# EAGLE design sample_holder (EAGLE 9.3.0)
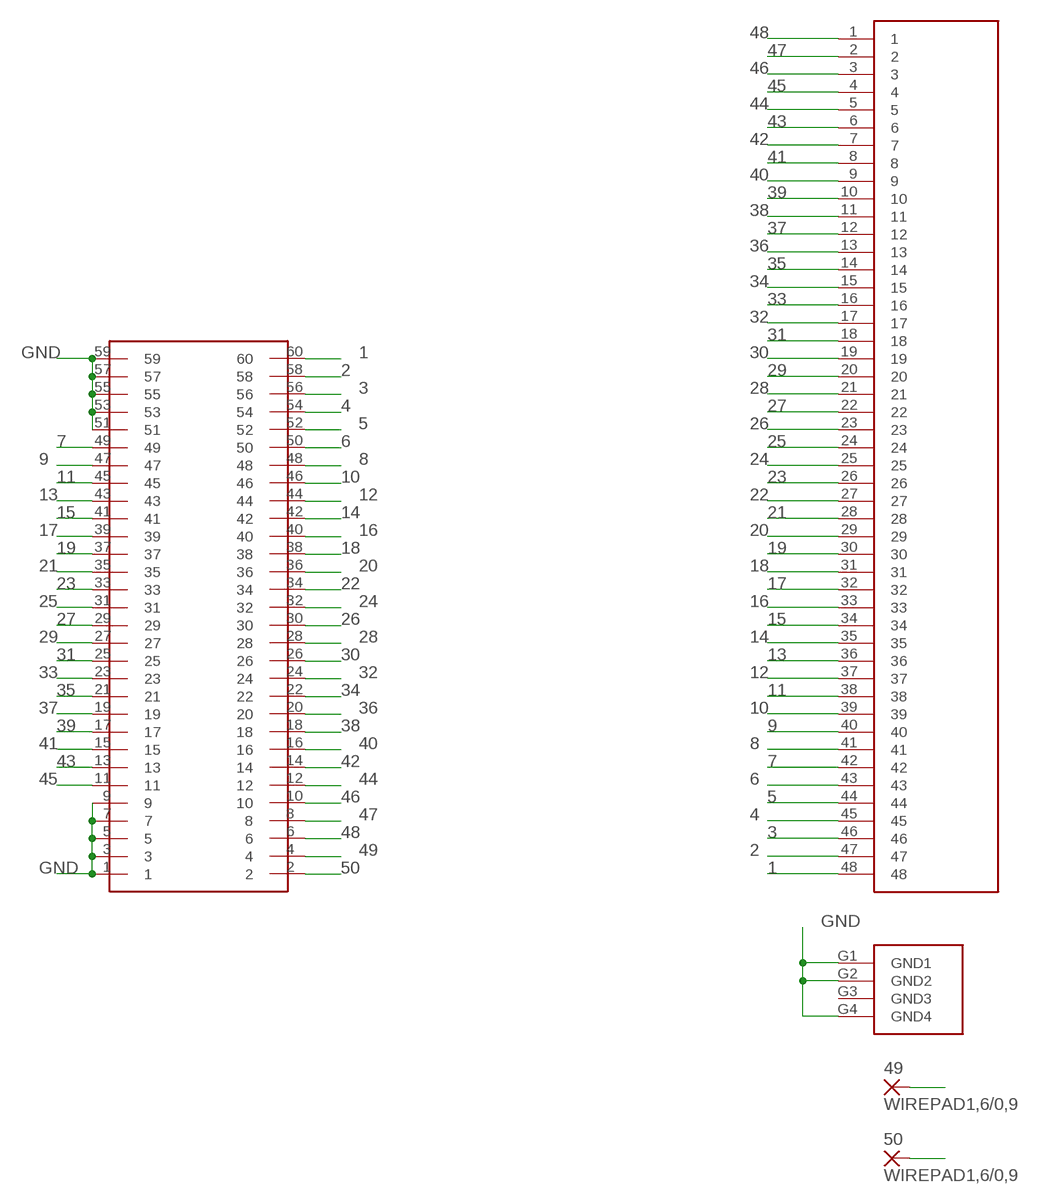
[diagram p0: schematic, sheet 1]

## Parts
49  WIREPAD1,6/0,9  [1,6/0,9]
50  WIREPAD1,6/0,9  [1,6/0,9]
U$1  MEC5-030-CARD-ALL  [MEC-030-CARD-ALL]
U$2  FOLKLAB-48PADS  [FOLKLAB-48PADS]

## Nets
1: U$1.60 U$2.48
2: U$1.58 U$2.47
3: U$1.56 U$2.46
4: U$1.54 U$2.45
5: U$1.52 U$2.44
6: U$1.50 U$2.43
7: U$1.49 U$2.42
8: U$1.48 U$2.41
9: U$1.47 U$2.40
10: U$1.46 U$2.39
11: U$1.45 U$2.38
12: U$1.44 U$2.37
13: U$1.43 U$2.36
14: U$1.42 U$2.35
15: U$1.41 U$2.34
16: U$1.40 U$2.33
17: U$1.39 U$2.32
18: U$1.38 U$2.31
19: U$1.37 U$2.30
20: U$1.36 U$2.29
21: U$1.35 U$2.28
22: U$1.34 U$2.27
23: U$1.33 U$2.26
24: U$1.32 U$2.25
25: U$1.31 U$2.24
26: U$1.30 U$2.23
27: U$1.29 U$2.22
28: U$1.28 U$2.21
29: U$1.27 U$2.20
30: U$1.26 U$2.19
31: U$1.25 U$2.18
32: U$1.24 U$2.17
33: U$1.23 U$2.16
34: U$1.22 U$2.15
35: U$1.21 U$2.14
36: U$1.20 U$2.13
37: U$1.19 U$2.12
38: U$1.18 U$2.11
39: U$1.17 U$2.10
40: U$1.16 U$2.9
41: U$1.15 U$2.8
42: U$1.14 U$2.7
43: U$1.13 U$2.6
44: U$1.12 U$2.5
45: U$1.11 U$2.4
46: U$1.10 U$2.3
47: U$1.8 U$2.2
48: U$1.6 U$2.1
49: 49.1(P) U$1.4
50: 50.1(P) U$1.2
GND: U$1.1 U$1.3 U$1.5 U$1.7 U$1.9 U$1.51 U$1.53 U$1.55 U$1.57 U$1.59 U$2.G1(GND1) U$2.G2(GND2) U$2.G4(GND4)
Unconnected: U$2.G3(GND3)

## Library data of the parts
49 50 = wirepad:WIREPAD: Wire PAD connect wire on PCB
U$1 = MEC5-030-01-L-RA-CARD:MEC5-030-CARD-ALL
U$2 = FolkLab-48pads:FOLKLAB-48PADS

## Net classes
0 default: width 0.152 mm, clearance 0.152 mm

## Board
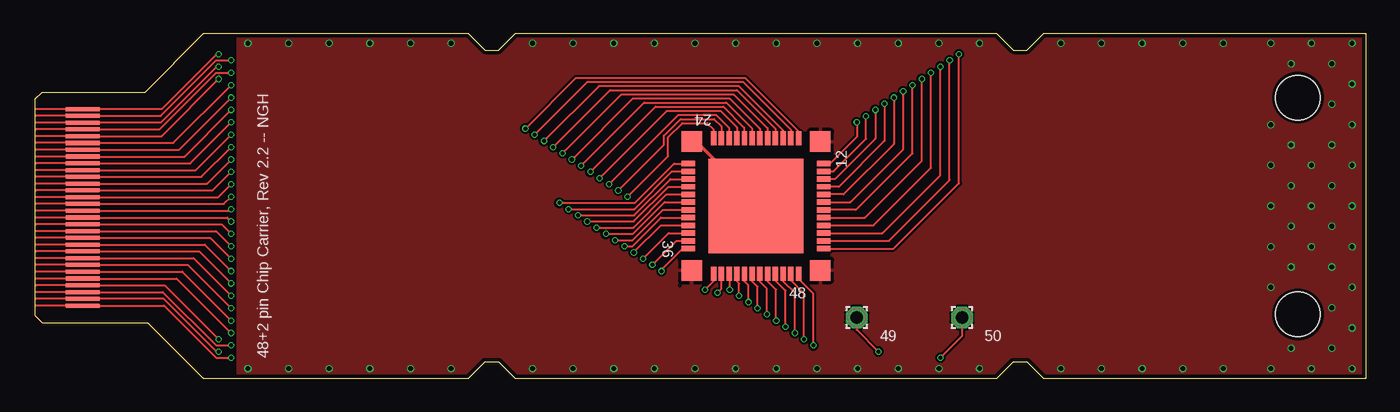
[diagram p1: board, top side]
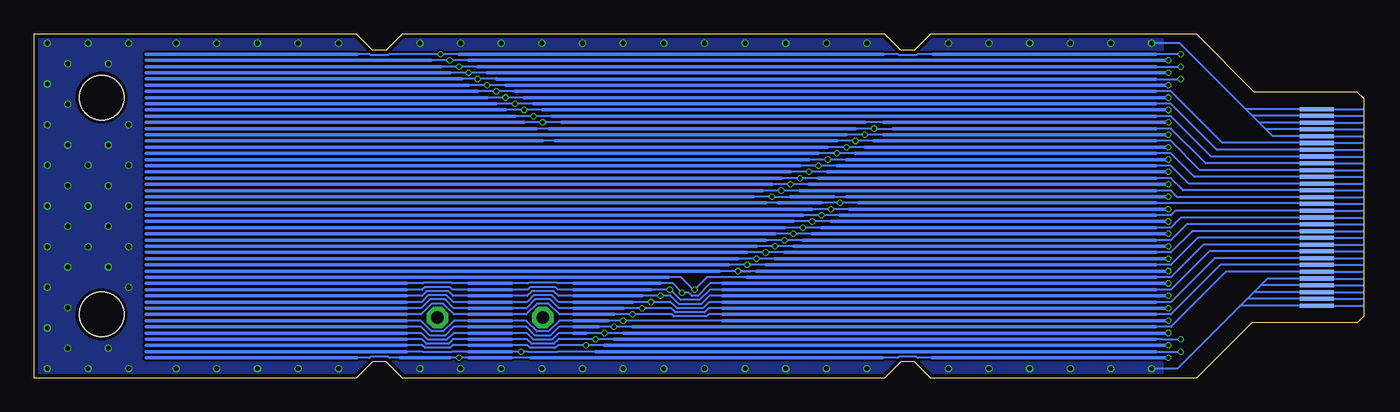
[diagram p2: board, bottom side, seen from below]

Size 98.2 x 25.4 mm. Coordinates in mm from the lower left corner, seen from the top.
Outline: 98.2,25.4 98.2,0 74.4,0 73.2,1.2 72.2,1.2 71,0 35.4,0 34.2,1.2 33.2,1.2 32,0 12.4,0 8.3,4.1 0.5,4.1 0,4.6 0,20.6 0.5,21.1 3.1,21.1 8,21.1 8.1,21.1 12.4,25.4 32,25.4 33.2,24.2 34.2,24.2 35.4,25.4 71,25.4 72.2,24.2 73.2,24.2 74.4,25.4 98.2,25.4
Copper layers (1*16): Top 0.035mm / dielectric 0.2mm / Bottom 0.035mm
Design rules "default *": minimum track width 6mil, minimum drill 10mil, track to track 6mil, track to pad 6mil, pad to pad 6mil, via to via 6mil, smd to smd 6mil, copper to edge 10mil, drill to drill 10mil, minimum pad ring 5mil, minimum via ring 3mil, stop-mask expansion 4mil, vias tented up to drill 12mil, thermal gap 10mil
Holes 3.3 mm at 93.2,4.7 93.2,20.7

### Footprints (pad centres in the part's own frame; a part is rotated, then mirrored left to right if it is on the bottom)
1,6/0,9 = drill 0.914 pad 1.6 octagon: 1 0,0
MEC-030-CARD-ALL = smd 0.3 x 2.5 bottom: 1 -7.25,-3.5; 3 -6.75,-3.5; 5 -6.25,-3.5; 7 -5.75,-3.5; 9 -5.25,-3.5; 11 -4.75,-3.5; 13 -4.25,-3.5; 15 -3.75,-3.5; 17 -3.25,-3.5; 19 -2.75,-3.5; 21 -2.25,-3.5; 23 -1.75,-3.5; 25 -1.25,-3.5; 27 -0.75,-3.5; 29 -0.25,-3.5; 31 0.25,-3.5; 33 0.75,-3.5; 35 1.25,-3.5; 37 1.75,-3.5; 39 2.25,-3.5; 41 2.75,-3.5; 43 3.25,-3.5; 45 3.75,-3.5; 47 4.25,-3.5; 49 4.75,-3.5; 51 5.25,-3.5; 53 5.75,-3.5; 55 6.25,-3.5; 57 6.75,-3.5; 59 7.25,-3.5 | smd 0.3 x 2.5: 2 -7.25,-3.5; 4 -6.75,-3.5; 6 -6.25,-3.5; 8 -5.75,-3.5; 10 -5.25,-3.5; 12 -4.75,-3.5; 14 -4.25,-3.5; 16 -3.75,-3.5; 18 -3.25,-3.5; 20 -2.75,-3.5; 22 -2.25,-3.5; 24 -1.75,-3.5; 26 -1.25,-3.5; 28 -0.75,-3.5; 30 -0.25,-3.5; 32 0.25,-3.5; 34 0.75,-3.5; 36 1.25,-3.5; 38 1.75,-3.5; 40 2.25,-3.5; 42 2.75,-3.5; 44 3.25,-3.5; 46 3.75,-3.5; 48 4.25,-3.5; 50 4.75,-3.5; 52 5.25,-3.5; 54 5.75,-3.5; 56 6.25,-3.5; 58 6.75,-3.5; 60 7.25,-3.5
FOLKLAB-48PADS = smd 7 x 7: 0 0,0 | smd 1 x 0.4: 1 -5,-3.14; 2 -5,-2.57; 3 -5,-2; 4 -5,-1.43; 5 -5,-0.86; 6 -5,-0.29; 7 -5,0.28; 8 -5,0.85; 9 -5,1.42; 10 -5,1.99; 11 -5,2.56; 12 -5,3.13; 25 5,3.13; 26 5,2.56; 27 5,1.99; 28 5,1.42; 29 5,0.85; 30 5,0.28; 31 5,-0.29; 32 5,-0.86; 33 5,-1.43; 34 5,-2; 35 5,-2.57; 36 5,-3.14 | smd 0.4 x 1: 13 -3.14,5; 14 -2.57,5; 15 -2,5; 16 -1.43,5; 17 -0.86,5; 18 -0.29,5; 19 0.28,5; 20 0.85,5; 21 1.42,5; 22 1.99,5; 23 2.56,5; 24 3.13,5; 37 3.13,-5; 38 2.56,-5; 39 1.99,-5; 40 1.42,-5; 41 0.85,-5; 42 0.28,-5; 43 -0.29,-5; 44 -0.86,-5; 45 -1.43,-5; 46 -2,-5; 47 -2.57,-5; 48 -3.14,-5 | smd 1.5 x 1.5: G1 -4.75,-4.75; G2 -4.75,4.75; G3 4.75,4.75; G4 4.75,-4.75

### Placement (x,y rotation side)
49  60.64,4.47 0 top
50  68.41,4.47 0 top
U$1  0,12.6 90 top
U$2  53.2,12.7 90 top

### Tracks (layer width: path | path; a pad name or v marks a point on that pad's centre or on a via)
1  (via drill 0.3)
  Top 0.152: U$2.48 63.36,9.56 68.18,14.38 v68.18,23.9 | U$1.60 9.33,19.85 13.38,23.9 v13.54,23.9
  Bottom 0.152: v13.54,23.9 15.37,23.9 | 31.83,23.9 32.98,23.9 33.05,23.83 34.35,23.83 34.42,23.9 35.49,23.9 | 66.81,23.9 v68.18,23.9 71.98,23.9 72.05,23.83 73.35,23.83 73.42,23.9 74.35,23.9
  Bottom 0.254: 15.37,23.9 31.83,23.9 | 35.49,23.9 66.81,23.9 | 74.35,23.9 89.9,23.9
2  (via drill 0.3)
  Top 0.152: U$2.47 63.02,10.13 67.49,14.6 v67.49,23.44 | v14.46,23.44 13.36,23.44 9.26,19.35 U$1.58
  Bottom 0.152: 66.12,23.44 v67.49,23.44 68.87,23.44
  Bottom 0.254: v14.46,23.44 66.12,23.44 | 68.87,23.44 89.9,23.44
3  (via drill 0.3, 0.3 pad 0.08)
  Top 0.152: U$2.46 62.52,10.7 66.81,14.99 v66.81,22.99 | U$1.56 9.25,18.85 13.38,22.99 v13.54,22.99
  Bottom 0.152: v13.54,22.99 v13.55,22.98 15.37,22.98 | 65.44,22.99 v66.81,22.99 68.18,22.99
  Bottom 0.254: 15.37,22.98 65.43,22.98 65.44,22.99 | 68.18,22.99 89.9,22.99
4  (via drill 0.3 pad 0.08)
  Top 0.152: U$2.45 61.87,11.27 66.12,15.52 v66.12,22.53 | v14.46,22.53 13.36,22.53 9.18,18.35 U$1.54
  Bottom 0.152: 64.75,22.53 v66.12,22.53 67.49,22.53
  Bottom 0.254: v14.46,22.53 64.75,22.53 | 67.49,22.53 89.9,22.53
5  (via drill 0.3, 0.3 pad 0.08)
  Top 0.152: U$2.44 61.22,11.84 65.44,16.05 v65.44,22.07 | U$1.52 9.32,17.85 v13.54,22.07
  Bottom 0.152: v13.54,22.07 v13.55,22.07 15.37,22.07 | 64.06,22.07 v65.44,22.07 66.58,22.07 66.81,22.07
  Bottom 0.254: 15.37,22.07 64.06,22.07 | 66.58,22.07 89.9,22.07
6  (via drill 0.3 pad 0.08)
  Top 0.152: v64.75,21.61 64.75,16.59 60.58,12.41 U$2.43 | U$1.50 10.19,17.35 v14.46,21.61
  Bottom 0.152: 63.38,21.61 v64.75,21.61 66.12,21.61
  Bottom 0.254: v14.46,21.61 63.38,21.61 | 66.12,21.61 89.9,21.61
7  (via drill 0.3 pad 0.08)
  Top 0.152: U$2.42 60.15,12.98 64.06,16.89 v64.06,21.16
  Bottom 0.152: 15.37,21.16 14.27,21.16 10.46,17.35 U$1.49 | 62.69,21.16 v64.06,21.16 65.44,21.16
  Bottom 0.254: 15.37,21.16 62.69,21.16 | 65.44,21.16 89.9,21.16
8  (via drill 0.3 pad 0.08)
  Top 0.152: v63.38,20.7 63.38,17.27 59.66,13.55 U$2.41 | U$1.48 10.61,16.85 v14.46,20.7
  Bottom 0.152: 62.01,20.7 v63.38,20.7 64.75,20.7
  Bottom 0.254: v14.46,20.7 62.01,20.7 | 64.75,20.7 89.9,20.7
9  (via drill 0.3 pad 0.08)
  Top 0.152: v62.69,20.24 62.69,17.5 59.31,14.12 U$2.40
  Bottom 0.152: 15.37,20.24 14.27,20.24 10.88,16.85 U$1.47 | 61.32,20.24 v62.69,20.24 64.06,20.24
  Bottom 0.254: 15.37,20.24 61.32,20.24 | 64.06,20.24 89.9,20.24
10  (via drill 0.3 pad 0.08)
  Top 0.152: v62.01,19.79 v62.01,19.78 62.01,17.68 59.02,14.69 U$2.39 | U$1.46 11.02,16.35 v14.46,19.79
  Bottom 0.152: 60.64,19.79 v62.01,19.79 63.38,19.79
  Bottom 0.254: v14.46,19.79 60.64,19.79 | 63.38,19.79 89.9,19.79
11  (via drill 0.3 pad 0.08)
  Top 0.152: U$2.38 58.93,15.26 61.32,17.65 v61.32,19.33
  Bottom 0.152: 15.37,19.33 14.27,19.33 11.29,16.35 U$1.45 | 59.95,19.33 v61.32,19.33 62.69,19.33
  Bottom 0.254: 15.37,19.33 59.95,19.33 | 62.69,19.33 89.9,19.33
12  (via drill 0.3 pad 0.08)
  Top 0.152: v60.64,18.87 60.64,17.8 58.66,15.83 U$2.37 | U$1.44 11.44,15.85 v14.46,18.87
  Bottom 0.152: 62.01,18.87 v60.64,18.87 59.26,18.87 | 35.49,18.87 36.86,18.87
  Bottom 0.254: v14.46,18.87 35.49,18.87 | 62.01,18.87 89.9,18.87 | 36.86,18.87 59.26,18.87
13  (via drill 0.3 pad 0.33)
  Top 0.152: v36.18,18.41 39.92,22.16 52.39,22.16 56.34,18.21 U$2.36
  Bottom 0.152: 15.37,18.41 14.27,18.41 11.71,15.85 U$1.43 | 34.8,18.41 v36.18,18.41 37.55,18.41 | 60.18,18.41 61.09,18.41
  Bottom 0.254: 61.09,18.41 89.9,18.41 | 15.37,18.41 34.8,18.41 | 37.55,18.41 60.18,18.41
14  (via drill 0.3 pad 0.08, 0.3 pad 0.33)
  Top 0.152: v36.86,17.96 40.76,21.86 52.24,21.86 55.77,18.33 U$2.35 | U$1.42 11.85,15.35 v14.46,17.96
  Bottom 0.152: 35.49,17.96 v36.86,17.96 38.23,17.96
  Bottom 0.254: v14.46,17.96 35.49,17.96 | 38.23,17.96 89.9,17.96
15  (via drill 0.3 pad 0.08)
  Top 0.152: v37.55,17.5 41.6,21.55 51.94,21.55 55.2,18.29 U$2.34
  Top 0.203: U$2.34 55.24,17.74
  Bottom 0.152: 15.37,17.5 14.27,17.5 12.12,15.35 U$1.41 | 36.18,17.5 v37.55,17.5 38.92,17.5 | 59.72,17.5 60.64,17.5
  Bottom 0.254: 15.37,17.5 36.18,17.5 | 60.64,17.5 89.9,17.5 | 38.92,17.5 59.72,17.5
16  (via drill 0.3 pad 0.08)
  Top 0.152: v38.23,17.04 42.44,21.25 51.78,21.25 54.63,18.4 U$2.33 | U$1.40 12.26,14.85 v14.46,17.04
  Bottom 0.152: 36.86,17.04 v38.23,17.04 39.61,17.04
  Bottom 0.254: 39.61,17.04 89.9,17.04 | v14.46,17.04 36.86,17.04
17  (via drill 0.3 pad 0.08)
  Top 0.152: v38.92,16.59 43.28,20.94 51.55,20.94 54.06,18.44 U$2.32
  Bottom 0.152: 15.37,16.58 14.27,16.58 12.54,14.85 U$1.39 | 37.55,16.58 v38.92,16.58 v38.92,16.59 40.29,16.59
  Bottom 0.254: 15.37,16.58 37.55,16.58 37.55,16.59 | 40.29,16.59 89.9,16.59
18  (via drill 0.3 pad 0.08)
  Top 0.152: v39.61,16.13 44.11,20.64 51.25,20.64 53.49,18.4 U$2.31 | U$1.38 12.68,14.35 v14.46,16.13
  Bottom 0.152: 38.23,16.13 v39.61,16.13 40.98,16.13
  Bottom 0.254: v14.46,16.13 38.23,16.13 | 40.98,16.13 89.9,16.13
19  (via drill 0.3 pad 0.08)
  Top 0.152: v40.29,15.67 44.95,20.33 51.02,20.33 52.92,18.43 U$2.30
  Bottom 0.152: 15.37,15.67 14.27,15.67 12.95,14.35 U$1.37 | 41.66,15.67 v40.29,15.67 38.92,15.67
  Bottom 0.254: 15.37,15.67 38.92,15.67 | 41.66,15.67 89.9,15.67
20  (via drill 0.3 pad 0.08)
  Top 0.152: v40.98,15.21 45.79,20.03 50.79,20.03 52.33,18.49 52.33,17.72 U$2.29 | U$1.36 13.09,13.85 v14.46,15.21
  Bottom 0.152: 39.61,15.21 v40.98,15.21 42.35,15.21
  Bottom 0.254: v14.46,15.21 39.61,15.21 | 42.35,15.21 89.9,15.21
21  (via drill 0.3 pad 0.08)
  Top 0.152: v41.66,14.76 46.63,19.72 50.56,19.72 51.78,18.51 U$2.28
  Bottom 0.152: 15.37,14.75 14.27,14.75 13.36,13.85 U$1.35 | 40.29,14.76 v41.66,14.76 43.03,14.76
  Bottom 0.254: 15.37,14.75 40.29,14.75 40.29,14.76 | 43.03,14.76 89.9,14.76
22  (via drill 0.3 pad 0.08)
  Top 0.152: v42.35,14.3 47.47,19.42 50.26,19.42 51.21,18.47 U$2.27 | U$1.34 13.51,13.35 v14.46,14.3
  Bottom 0.152: 40.98,14.3 v42.35,14.3 43.72,14.3
  Bottom 0.254: v14.46,14.3 40.98,14.3 | 43.72,14.3 89.9,14.3
23  (via drill 0.3 pad 0.08)
  Top 0.152: v43.03,13.84 46.41,17.21 46.41,17.89 47.63,19.11 50.11,19.11 50.64,18.58 U$2.26
  Top 0.203: 50.59,17.75 U$2.26
  Bottom 0.152: 15.37,13.84 14.4,13.84 14.27,13.84 13.78,13.35 U$1.33 | 41.43,13.84 41.44,13.84 v43.03,13.84 44.41,13.84
  Bottom 0.254: 15.37,13.84 41.43,13.84 41.66,13.84 | 44.41,13.84 89.9,13.84
24  (via drill 0.3 pad 0.08)
  Top 0.152: v43.72,13.39 46.71,16.38 46.71,17.76 47.76,18.81 49.59,18.81 50.05,18.34 50.05,17.72 U$2.25 | U$1.32 13.92,12.85 v14.46,13.39
  Bottom 0.152: 45.09,13.39 v43.72,13.39 42.35,13.39 | 39.15,13.39 38.23,13.39
  Bottom 0.254: v14.46,13.39 38.23,13.39 | 45.09,13.39 89.9,13.39 | 42.35,13.39 39.15,13.39
25  (via drill 0.3 pad 0.08)
  Top 0.152: v38.69,12.93 44.25,12.93 47.15,15.83 U$2.24
  Bottom 0.152: 37.32,12.93 v38.69,12.93 40.06,12.93 | 43.26,12.93 44.18,12.93 | 15.37,12.93 3.58,12.93 U$1.31
  Bottom 0.254: 15.37,12.93 35.26,12.93 | 35.26,12.93 | 44.18,12.93 89.9,12.93 | 35.26,12.93 37.32,12.93 | 40.06,12.93 43.26,12.93
26  (via drill 0.3 pad 0.08)
  Top 0.152: v39.38,12.47 44.23,12.47 47.02,15.26 U$2.23 | U$1.30 14.34,12.35 v14.46,12.47
  Bottom 0.152: 38.01,12.47 v39.38,12.47 40.75,12.47
  Bottom 0.254: v14.46,12.47 38.01,12.47 | 40.75,12.47 89.9,12.47
27  (via drill 0.3 pad 0.08)
  Top 0.152: v40.06,12.01 44.2,12.01 46.88,14.69 U$2.22
  Bottom 0.152: 15.37,12.01 14.27,12.01 13.93,12.35 U$1.29 | 38.69,12.01 v40.06,12.01 41.43,12.01
  Bottom 0.254: 15.37,12.01 38.69,12.01 | 41.43,12.01 89.9,12.01
28  (via drill 0.3 pad 0.08)
  Top 0.152: v40.75,11.56 44.18,11.56 46.74,14.12 U$2.21 | U$1.28 14.17,11.85 v14.46,11.56
  Bottom 0.152: 39.15,11.56 v40.75,11.56 42.12,11.56
  Bottom 0.254: v14.46,11.56 39.15,11.56 39.38,11.56 | 42.12,11.56 89.9,11.56
29  (via drill 0.3 pad 0.08)
  Top 0.152: v41.43,11.1 44.15,11.1 46.6,13.55 U$2.20
  Bottom 0.152: 40.06,11.1 v41.43,11.1 42.8,11.1 | U$1.27 13.53,11.85 14,11.37 14.27,11.1 15.37,11.1
  Bottom 0.254: 15.37,11.1 40.06,11.1 | 42.8,11.1 89.9,11.1
30  (via drill 0.3 pad 0.08)
  Top 0.152: v42.12,10.64 44.12,10.64 46.46,12.98 U$2.19 | U$1.26 13.75,11.35 v14.46,10.64
  Bottom 0.152: 40.52,10.64 v42.12,10.64 43.49,10.64
  Bottom 0.254: v14.46,10.64 40.52,10.64 40.75,10.64 | 43.49,10.64 89.9,10.64
31  (via drill 0.3 pad 0.08)
  Top 0.152: v42.8,10.18 44.1,10.18 46.32,12.41 U$2.18
  Bottom 0.152: 15.37,10.19 14.27,10.19 13.11,11.35 U$1.25 | 41.43,10.18 v42.8,10.18 44.18,10.18
  Bottom 0.254: 15.37,10.19 41.43,10.19 41.43,10.18 | 44.18,10.18 89.9,10.18
32  (via drill 0.3 pad 0.08)
  Top 0.152: v43.49,9.73 44.07,9.73 46.18,11.84 U$2.17 | U$1.24 13.34,10.85 v14.46,9.73
  Bottom 0.152: 41.89,9.73 v43.49,9.73 44.86,9.73
  Bottom 0.254: v14.46,9.73 41.89,9.73 42.12,9.73 | 44.86,9.73 89.9,9.73
33  (via drill 0.3 pad 0.08)
  Top 0.152: v44.18,9.27 46.18,11.27 U$2.16
  Bottom 0.152: 15.37,9.27 14.27,9.27 12.69,10.85 U$1.23 | 42.8,9.27 v44.18,9.27 45.55,9.27
  Bottom 0.254: 15.37,9.27 42.8,9.27 | 45.55,9.27 89.9,9.27
34  (via drill 0.3 pad 0.08)
  Top 0.152: v44.86,8.81 46.75,10.7 U$2.15 | U$1.22 12.92,10.35 v14.46,8.81
  Bottom 0.152: 43.49,8.81 v44.86,8.81 46.23,8.81
  Bottom 0.254: v14.46,8.81 43.49,8.81 | 46.23,8.81 89.9,8.81
35  (via drill 0.3 pad 0.08)
  Top 0.152: v45.55,8.36 47.32,10.13 U$2.14
  Bottom 0.152: 15.37,8.36 14.27,8.36 12.28,10.35 U$1.21 | 46.92,8.36 v45.55,8.36 44.17,8.36
  Bottom 0.254: 15.37,8.36 44.17,8.36 44.18,8.36 | 46.92,8.36 89.9,8.36
36  (via drill 0.3 pad 0.08)
  Top 0.152: v46.23,7.9 46.23,8 47.79,9.56 U$2.13 | U$1.20 12.51,9.85 v14.46,7.9
  Bottom 0.152: 44.86,7.9 v46.23,7.9 | v46.23,7.9 45.32,7.9 | v46.23,7.9 47.61,7.9
  Bottom 0.254: v14.46,7.9 44.86,7.9 | 47.61,7.9 89.9,7.9
37  (via drill 0.3)
  Top 0.152: v49.44,6.53 50.07,7.16 U$2.12
  Bottom 0.152: 15.37,7.44 14.27,7.44 11.86,9.85 U$1.19 | 45.55,7.44 48.52,7.44 v49.44,6.53 49.51,6.53 50.43,7.44 51.34,7.44
  Bottom 0.254: 15.37,7.44 45.55,7.44 | 51.34,7.44 89.9,7.44
38  (via drill 0.3, 0.3 pad 0.08)
  Top 0.152: v50.35,6.3 50.64,6.59 U$2.11 | U$1.18 12.09,9.35 v14.46,6.98
  Bottom 0.152: 58.35,6.98 59.54,6.98 59.58,7.02 61.69,7.02 61.73,6.98 62.92,6.98 | 66.12,6.98 67.31,6.98 67.35,7.02 69.47,7.02 69.5,6.98 70.69,6.98 | 47.15,6.98 48.28,6.98 49.2,6.07 49.62,6.07 49.85,6.3 v50.35,6.3 51.04,6.98 51.95,6.98 52.03,6.98
  Bottom 0.254: v14.46,6.98 47.15,6.98 47.38,6.98 | 62.92,6.98 66.12,6.98 | 70.69,6.98 89.9,6.98 | 51.95,6.98 58.35,6.98
39  (via drill 0.3 pad 0.08)
  Top 0.152: v51.26,6.53 51.26,7.65 U$2.10
  Bottom 0.152: 15.37,6.53 14.27,6.53 11.45,9.35 U$1.17 | 52.64,6.53 v51.26,6.53 51.22,6.53 50.46,5.77 49.07,5.77 48.31,6.53 47.38,6.53 | 58.35,6.53 59.51,6.53 59.71,6.72 61.57,6.72 61.76,6.53 62.92,6.53 | 66.12,6.53 67.29,6.53 67.48,6.72 69.34,6.72 69.54,6.52 69.55,6.53 70.69,6.53
  Bottom 0.254: 15.37,6.53 36.63,6.53 47.38,6.53 | 52.64,6.53 58.35,6.53 | 62.92,6.53 66.12,6.53 | 70.69,6.53 89.9,6.53
40  (via drill 0.3 pad 0.08)
  Top 0.152: v51.95,6.07 51.95,6.98 51.78,7.15 U$2.9 | U$1.16 11.68,8.85 v14.46,6.07
  Bottom 0.152: 53.32,6.07 v51.95,6.07 51.2,6.07 50.59,5.46 48.94,5.46 48.34,6.07 47.38,6.07 | 58.35,6.07 59.49,6.07 59.83,6.41 61.44,6.41 61.78,6.07 62.92,6.07 | 66.12,6.07 67.26,6.07 67.6,6.41 69.21,6.41 69.56,6.07 70.69,6.07
  Bottom 0.254: v14.46,6.07 47.38,6.07 | 53.32,6.07 58.35,6.07 | 62.92,6.07 66.12,6.07 | 70.69,6.07 89.9,6.07
41  (via drill 0.3 pad 0.08)
  Top 0.152: v52.64,5.61 52.64,6.86 52.35,7.14 U$2.8
  Bottom 0.152: 15.37,5.62 14.27,5.62 11.04,8.85 U$1.15 | 54.01,5.61 v52.64,5.61 v52.63,5.62 51.17,5.62 50.71,5.16 48.82,5.16 48.36,5.62 47.38,5.62 | 58.35,5.61 59.46,5.61 59.96,6.11 61.32,6.11 61.81,5.61 62.92,5.61 | 66.12,5.61 67.23,5.61 67.73,6.11 69.09,6.11 69.58,5.61 70.69,5.61
  Bottom 0.254: 15.37,5.62 36.63,5.62 | 36.63,5.62 36.63,5.61 | 36.63,5.62 47.38,5.62 | 54.01,5.61 58.35,5.61 | 62.92,5.61 66.12,5.61 | 70.69,5.61 89.9,5.61
42  (via drill 0.3 pad 0.08)
  Top 0.152: v53.32,5.16 53.32,6.76 52.92,7.16 U$2.7 | U$1.14 11.26,8.35 v14.46,5.16
  Bottom 0.152: 54.69,5.16 v53.32,5.16 51.14,5.16 50.84,4.85 48.69,4.85 48.39,5.16 47.38,5.16 | 58.35,5.16 59.44,5.16 60.08,5.8 61.19,5.8 61.84,5.16 62.92,5.16 | 66.12,5.16 67.21,5.16 67.86,5.8 68.96,5.8 69.61,5.16 70.69,5.16
  Bottom 0.254: v14.46,5.16 47.38,5.16 | 54.69,5.16 58.35,5.16 | 62.92,5.16 66.12,5.16 | 70.69,5.16 89.9,5.16
43  (via drill 0.3 pad 0.08)
  Top 0.152: v54.01,4.7 54.01,6.6 53.49,7.12 U$2.6
  Bottom 0.152: 15.37,4.7 14.27,4.7 10.62,8.35 U$1.13 | 58.35,4.7 59.41,4.7 60.21,5.5 61.06,5.5 61.86,4.7 62.92,4.7 | 66.12,4.7 67.18,4.7 67.98,5.5 68.84,5.5 69.64,4.7 70.69,4.7 | 47.38,4.7 48.41,4.7 48.56,4.55 50.97,4.55 51.12,4.7 v54.01,4.7 55.38,4.7
  Bottom 0.254: 15.37,4.7 47.38,4.7 | 55.38,4.7 58.35,4.7 | 62.92,4.7 66.12,4.7 | 70.69,4.7 89.9,4.7
44  (via drill 0.3 pad 0.08)
  Top 0.152: v54.69,4.24 54.69,6.53 54.06,7.16 U$2.5 | U$1.12 10.85,7.85 v14.46,4.24
  Bottom 0.152: 55.84,4.24 v54.69,4.24 47.38,4.24 | 58.35,4.24 59.41,4.24 60.21,3.44 61.06,3.44 61.86,4.24 62.92,4.24 | 66.12,4.24 67.18,4.24 67.98,3.44 68.84,3.44 69.64,4.24 70.69,4.24
  Bottom 0.254: v14.46,4.24 47.38,4.24 | 55.84,4.24 58.35,4.24 | 62.92,4.24 66.12,4.24 | 70.69,4.24 89.9,4.24
45  (via drill 0.3 pad 0.08)
  Top 0.152: v55.38,3.79 55.38,6.45 54.63,7.2 U$2.4
  Bottom 0.152: 15.37,3.79 14.27,3.79 10.21,7.85 U$1.11 | 56.75,3.79 56.52,3.79 v55.38,3.79 54.01,3.79 | 58.35,3.79 59.44,3.79 60.08,3.14 61.19,3.14 61.84,3.79 62.92,3.79 | 66.12,3.79 67.21,3.79 67.86,3.14 68.96,3.14 69.61,3.79 70.69,3.79
  Bottom 0.254: 15.37,3.79 54.01,3.79 | 56.52,3.79 58.35,3.79 | 62.92,3.79 66.12,3.79 | 70.69,3.79 89.9,3.79
46  (via drill 0.3 pad 0.08)
  Top 0.152: v56.06,3.33 56.06,6.3 55.2,7.16 U$2.3 | U$1.10 10.44,7.35 v14.46,3.33
  Bottom 0.152: 57.44,3.33 v56.06,3.33 54.69,3.33 | 58.35,3.33 59.46,3.33 59.96,2.83 61.32,2.83 61.81,3.33 62.92,3.33 | 66.12,3.33 67.23,3.33 67.73,2.83 69.09,2.83 69.58,3.33 70.69,3.33
  Bottom 0.254: v14.46,3.33 54.69,3.33 | 57.44,3.33 58.35,3.33 | 62.92,3.33 66.12,3.33 | 70.69,3.33 89.9,3.33
47  (via drill 0.3, 0.3 pad 0.08)
  Top 0.152: U$2.2 55.77,7.2 56.75,6.22 v56.75,2.87 | U$1.8 9.56,6.85 v13.54,2.87
  Bottom 0.152: 15.37,2.87 14.92,2.87 14.91,2.87 v13.54,2.87 | 55.15,2.87 v56.75,2.87 59.49,2.87 59.83,2.53 61.44,2.53 61.78,2.87 62.92,2.87 | 66.12,2.87 67.26,2.87 67.6,2.53 69.21,2.53 69.56,2.87 70.69,2.87
  Bottom 0.254: 15.37,2.87 55.15,2.87 55.38,2.87 | 62.92,2.87 66.12,2.87 | 70.69,2.87 89.9,2.87
48  (via drill 0.3 pad 0.08)
  Top 0.152: v57.44,2.41 57.44,6.22 56.34,7.32 U$2.1 | v14.46,2.41 13.36,2.41 9.42,6.35 U$1.6
  Bottom 0.152: 56.06,2.41 v57.44,2.41 59.51,2.41 59.71,2.22 61.57,2.22 61.76,2.41 62.92,2.41 | 66.12,2.41 67.29,2.41 67.48,2.22 69.34,2.22 69.53,2.41 70.69,2.41
  Bottom 0.254: v14.46,2.41 56.06,2.41 | 62.92,2.41 66.12,2.41 | 70.69,2.41 89.9,2.41
49  (via drill 0.3)
  Top 0.152: 49.1 60.64,3.56 v62.24,1.96 | U$1.4 9.49,5.85 13.38,1.96 v13.54,1.96
  Bottom 0.152: 15.37,1.96 v13.54,1.96 | 70.69,1.96 69.5,1.96 69.47,1.92 67.35,1.92 67.31,1.96 66.12,1.96 | 62.92,1.96 v62.24,1.96 61.73,1.96 61.69,1.92 59.58,1.92 59.54,1.96 56.75,1.96
  Bottom 0.254: 15.37,1.96 56.75,1.96 | 70.69,1.96 89.9,1.96 | 62.92,1.96 66.12,1.96
50  (via drill 0.3, 0.3 pad 0.08)
  Top 0.152: 50.1 68.41,3.1 v66.81,1.5 | v14.46,1.5 13.36,1.5 9.51,5.35 U$1.2
  Bottom 0.152: 31.91,1.5 32.98,1.5 33.05,1.57 34.35,1.57 34.42,1.5 35.57,1.5 | 71.15,1.5 71.98,1.5 72.05,1.57 73.35,1.57 73.42,1.5 74.35,1.5 | 61.55,1.5 62.92,1.5 | 66.12,1.5 v66.81,1.5 67.49,1.5
  Bottom 0.254: v14.46,1.5 31.91,1.5 | 74.35,1.5 89.9,1.5 | 62.92,1.5 66.12,1.5 | 67.49,1.5 71.15,1.5 | 35.57,1.5 61.55,1.5
GND  (via drill 0.35, 0.35 pad 0.53)
  Bottom 0.152: U$1.51 6.75,17.85 7.25,18.35 | v15.7,24.7 13.6,24.7 8.75,19.85 | 7.75,18.85 7.4,18.5 7.25,18.35 | 7.75,18.85 8.25,19.35 | U$1.55 7.75,18.85 | U$1.57 8.25,19.35 | 8.25,19.35 8.75,19.85 | U$1.59 8.75,19.85 | U$1.9 7.15,7.35 7.65,6.85 | v15.7,0.7 13.8,0.7 9.15,5.35 | U$1.7 7.65,6.85 | 7.65,6.85 8.15,6.35 | U$1.5 8.15,6.35 | 8.15,6.35 8.65,5.85 | U$1.3 8.65,5.85 | 8.65,5.85 9.15,5.35 | U$1.1 9.15,5.35 | U$1.53 7.25,18.35
  other vias: 92.7,17.2 92.7,14.2 92.7,11.2 92.7,8.2 91.2,9.7 91.2,12.7 91.2,15.7 18.7,0.7 21.7,0.7 24.7,0.7 27.7,0.7 30.7,0.7 36.7,0.7 39.7,0.7 42.7,0.7 45.7,0.7 48.7,0.7 51.7,0.7 57.7,0.7 60.7,0.7 63.7,0.7 69.7,0.7 75.7,0.7 78.7,0.7 81.7,0.7 84.7,0.7 87.7,0.7 87.7,24.7 84.7,24.7 81.7,24.7 78.7,24.7 75.7,24.7 69.7,24.7 60.7,24.7 57.7,24.7 54.7,24.7 51.7,24.7 48.7,24.7 45.7,24.7 42.7,24.7 39.7,24.7 36.7,24.7 30.7,24.7 27.7,24.7 24.7,24.7 21.7,24.7 18.7,24.7 94.2,15.7 97.2,15.7 95.7,14.2 94.2,12.7 94.2,9.7 91.2,6.7 91.2,18.7 97.2,18.7 95.7,17.2 95.7,11.2 95.7,8.2 97.2,9.7 97.2,6.7 91.2,0.7 94.2,0.7 97.2,0.7 95.7,2.2 92.7,2.2 97.2,3.7 95.7,5.2 97.2,12.7 95.7,20.2 97.2,21.7 95.7,23.2 92.7,23.2 94.2,24.7 91.2,24.7 97.2,24.7 63.7,24.7 66.7,24.7 66.7,0.7 54.7,0.7
  pour Top: 14.92,25.96 14.92,-1.02 99.04,-1.02 99.04,26.42 14.92,26.42
  pour Bottom: 14.92,26.42 14.92,-1.02 99.04,-1.02 99.04,26.42
N$1
  Top 0.254: 48.29,17.73 48.52,17.73 50.58,15.67

### Text on the board
tPlace: 24 | 12 | 36 | 48 | 48+2 pin Chip Carrier, Rev 2.2 -- NGH